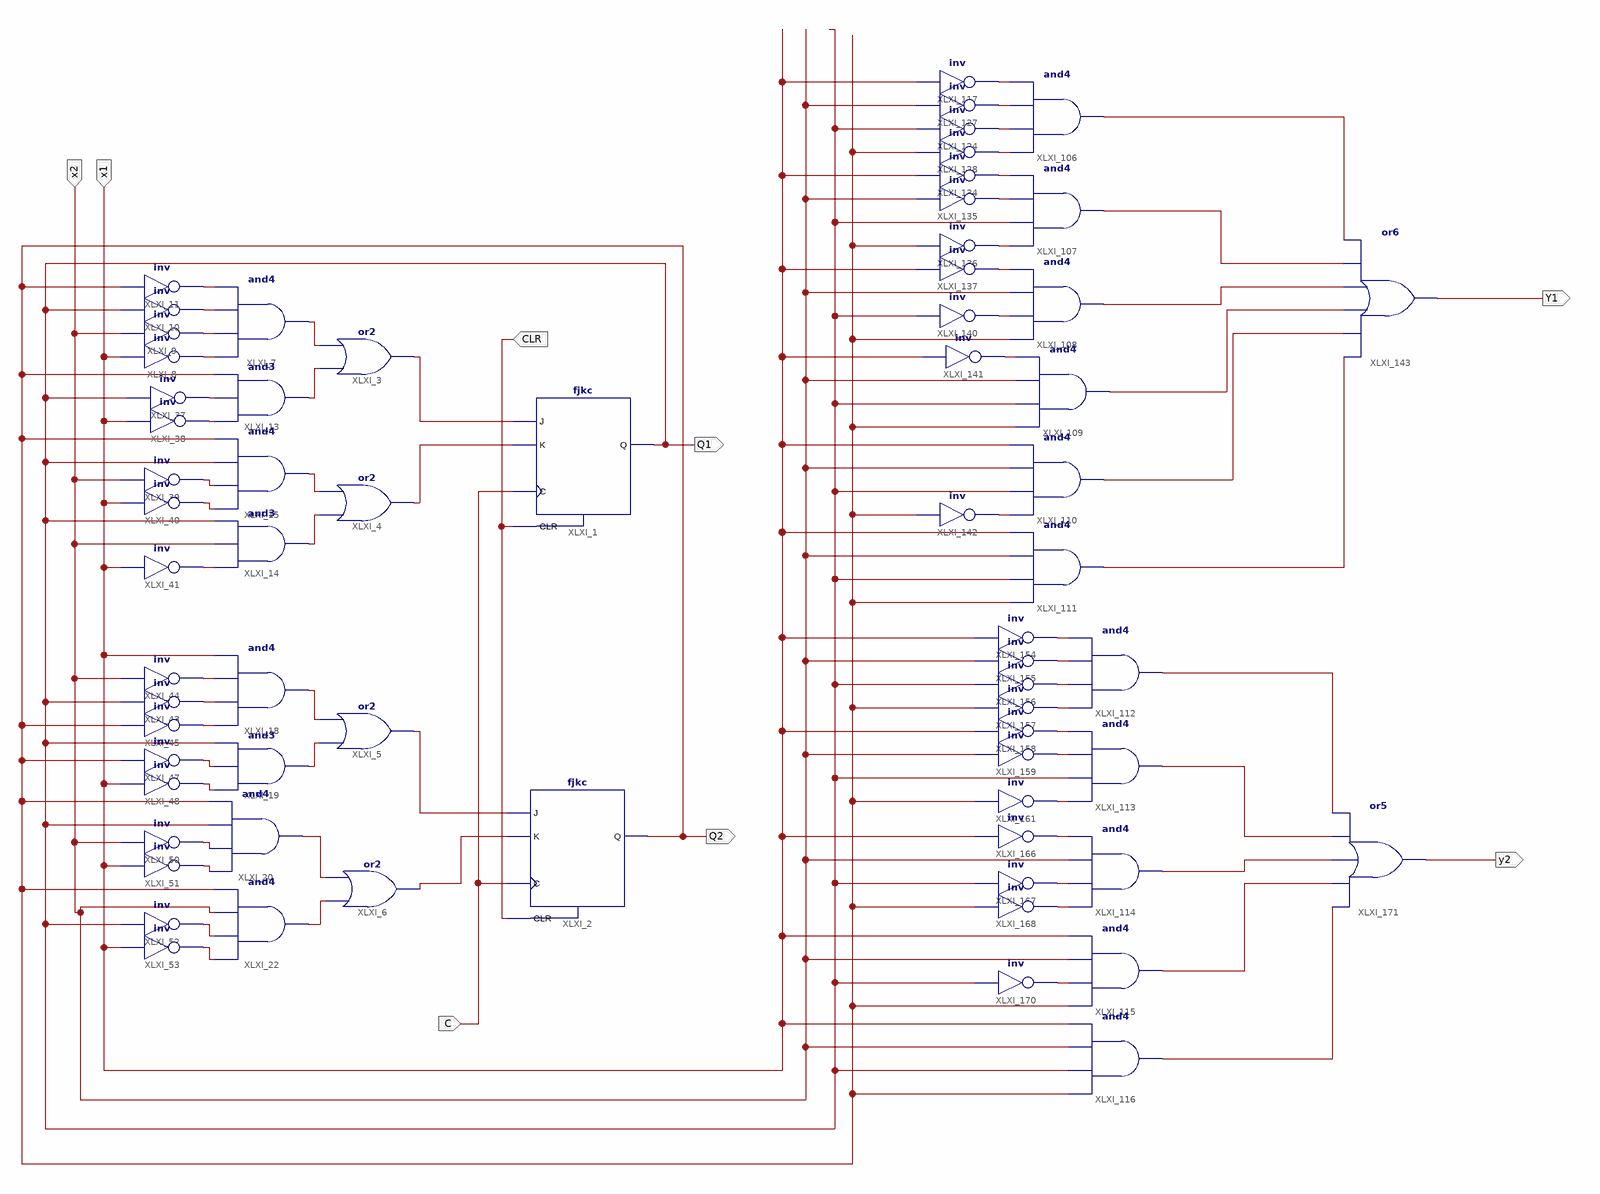
[diagram p0: schematic sheet 1]
// Xilinx ISE schematic shema.sch (xc9500) as structural Verilog: 67 symbols, 8 ports
module shema (
  input  x2,
  input  x1,
  input  C,
  input  CLR,
  output Y1,
  output y2,
  output Q1,
  output Q2
);

  wire XLXN_5, XLXN_6, XLXN_7, XLXN_8, XLXN_9, XLXN_10, XLXN_11, XLXN_12, XLXN_14, XLXN_15, XLXN_16, XLXN_17,
       XLXN_18, XLXN_19, XLXN_20, XLXN_21, XLXN_76, XLXN_77, XLXN_78, XLXN_79, XLXN_80, XLXN_81, XLXN_82,
       XLXN_83, XLXN_84, XLXN_85, XLXN_86, XLXN_87, XLXN_88, XLXN_89, XLXN_139, XLXN_140, XLXN_141, XLXN_142,
       XLXN_143, XLXN_144, XLXN_145, XLXN_147, XLXN_148, XLXN_149, XLXN_150, XLXN_151, XLXN_152, XLXN_154,
       XLXN_155, XLXN_156, XLXN_157, XLXN_159, XLXN_160, XLXN_161, XLXN_162, XLXN_163, XLXN_164, XLXN_165,
       XLXN_166, XLXN_167, XLXN_168, XLXN_169, XLXN_175, XLXN_176, XLXN_177, XLXN_178, XLXN_179;

  or XLXI_3 (XLXN_5, XLXN_15, XLXN_14);
  and XLXI_7 (XLXN_14, XLXN_9, XLXN_10, XLXN_11, XLXN_12);
  not XLXI_8 (XLXN_9, x1);
  not XLXI_9 (XLXN_10, x2);
  not XLXI_10 (XLXN_11, Q1);
  not XLXI_11 (XLXN_12, Q2);
  and XLXI_13 (XLXN_15, XLXN_77, XLXN_76, Q2);
  and XLXI_18 (XLXN_18, XLXN_83, XLXN_82, XLXN_81, x1);
  and XLXI_15 (XLXN_16, XLXN_79, XLXN_78, Q1, Q2);
  and XLXI_14 (XLXN_17, XLXN_80, x2, Q1);
  or XLXI_4 (XLXN_6, XLXN_17, XLXN_16);
  not XLXI_37 (XLXN_76, Q1);
  not XLXI_38 (XLXN_77, x1);
  not XLXI_39 (XLXN_78, x2);
  not XLXI_40 (XLXN_79, x1);
  not XLXI_41 (XLXN_80, x1);
  not XLXI_43 (XLXN_82, Q1);
  not XLXI_44 (XLXN_81, x2);
  not XLXI_45 (XLXN_83, Q2);
  fjkc XLXI_2 (.C(C), .CLR(CLR), .J(XLXN_7), .K(XLXN_8), .Q(Q2));
  or XLXI_6 (XLXN_8, XLXN_21, XLXN_20);
  or XLXI_5 (XLXN_7, XLXN_19, XLXN_18);
  not XLXI_47 (XLXN_84, Q2);
  not XLXI_53 (XLXN_89, x1);
  not XLXI_52 (XLXN_88, Q1);
  not XLXI_51 (XLXN_87, x1);
  not XLXI_50 (XLXN_86, x2);
  not XLXI_48 (XLXN_85, x1);
  and XLXI_22 (XLXN_21, XLXN_89, XLXN_88, x2, Q2);
  and XLXI_20 (XLXN_20, XLXN_87, XLXN_86, Q1, Q2);
  and XLXI_19 (XLXN_19, XLXN_85, XLXN_84, Q1);
  fjkc XLXI_1 (.C(C), .CLR(CLR), .J(XLXN_5), .K(XLXN_6), .Q(Q1));
  and XLXI_106 (XLXN_151, XLXN_142, XLXN_139, XLXN_141, XLXN_140);
  not XLXI_124 (XLXN_139, Q1);
  not XLXI_117 (XLXN_140, x1);
  not XLXI_127 (XLXN_141, x2);
  not XLXI_128 (XLXN_142, Q2);
  and XLXI_107 (XLXN_152, XLXN_145, Q1, XLXN_144, XLXN_143);
  and XLXI_108 (XLXN_154, Q2, XLXN_148, x2, XLXN_147);
  and XLXI_109 (XLXN_155, Q2, Q1, x2, XLXN_149);
  and XLXI_110 (XLXN_156, XLXN_150, Q1, x2, x1);
  and XLXI_111 (XLXN_157, Q2, Q1, x2, x1);
  not XLXI_134 (XLXN_143, x1);
  not XLXI_135 (XLXN_144, x2);
  not XLXI_136 (XLXN_145, Q2);
  not XLXI_137 (XLXN_147, x1);
  not XLXI_140 (XLXN_148, Q1);
  not XLXI_141 (XLXN_149, x1);
  not XLXI_142 (XLXN_150, Q2);
  or XLXI_143 (Y1, XLXN_157, XLXN_156, XLXN_155, XLXN_154, XLXN_152, XLXN_151);
  and XLXI_112 (XLXN_175, XLXN_162, XLXN_161, XLXN_160, XLXN_159);
  and XLXI_113 (XLXN_176, XLXN_165, Q1, XLXN_164, XLXN_163);
  not XLXI_154 (XLXN_159, x1);
  not XLXI_155 (XLXN_160, x2);
  not XLXI_156 (XLXN_161, Q1);
  not XLXI_157 (XLXN_162, Q2);
  not XLXI_158 (XLXN_163, x1);
  not XLXI_159 (XLXN_164, x2);
  not XLXI_161 (XLXN_165, Q2);
  and XLXI_114 (XLXN_177, XLXN_168, XLXN_167, x2, XLXN_166);
  and XLXI_115 (XLXN_178, Q2, XLXN_169, x2, x1);
  and XLXI_116 (XLXN_179, Q2, Q1, x2, x1);
  not XLXI_166 (XLXN_166, x1);
  not XLXI_167 (XLXN_167, Q1);
  not XLXI_168 (XLXN_168, Q2);
  not XLXI_170 (XLXN_169, Q1);
  or XLXI_171 (y2, XLXN_179, XLXN_178, XLXN_177, XLXN_176, XLXN_175);
endmodule
